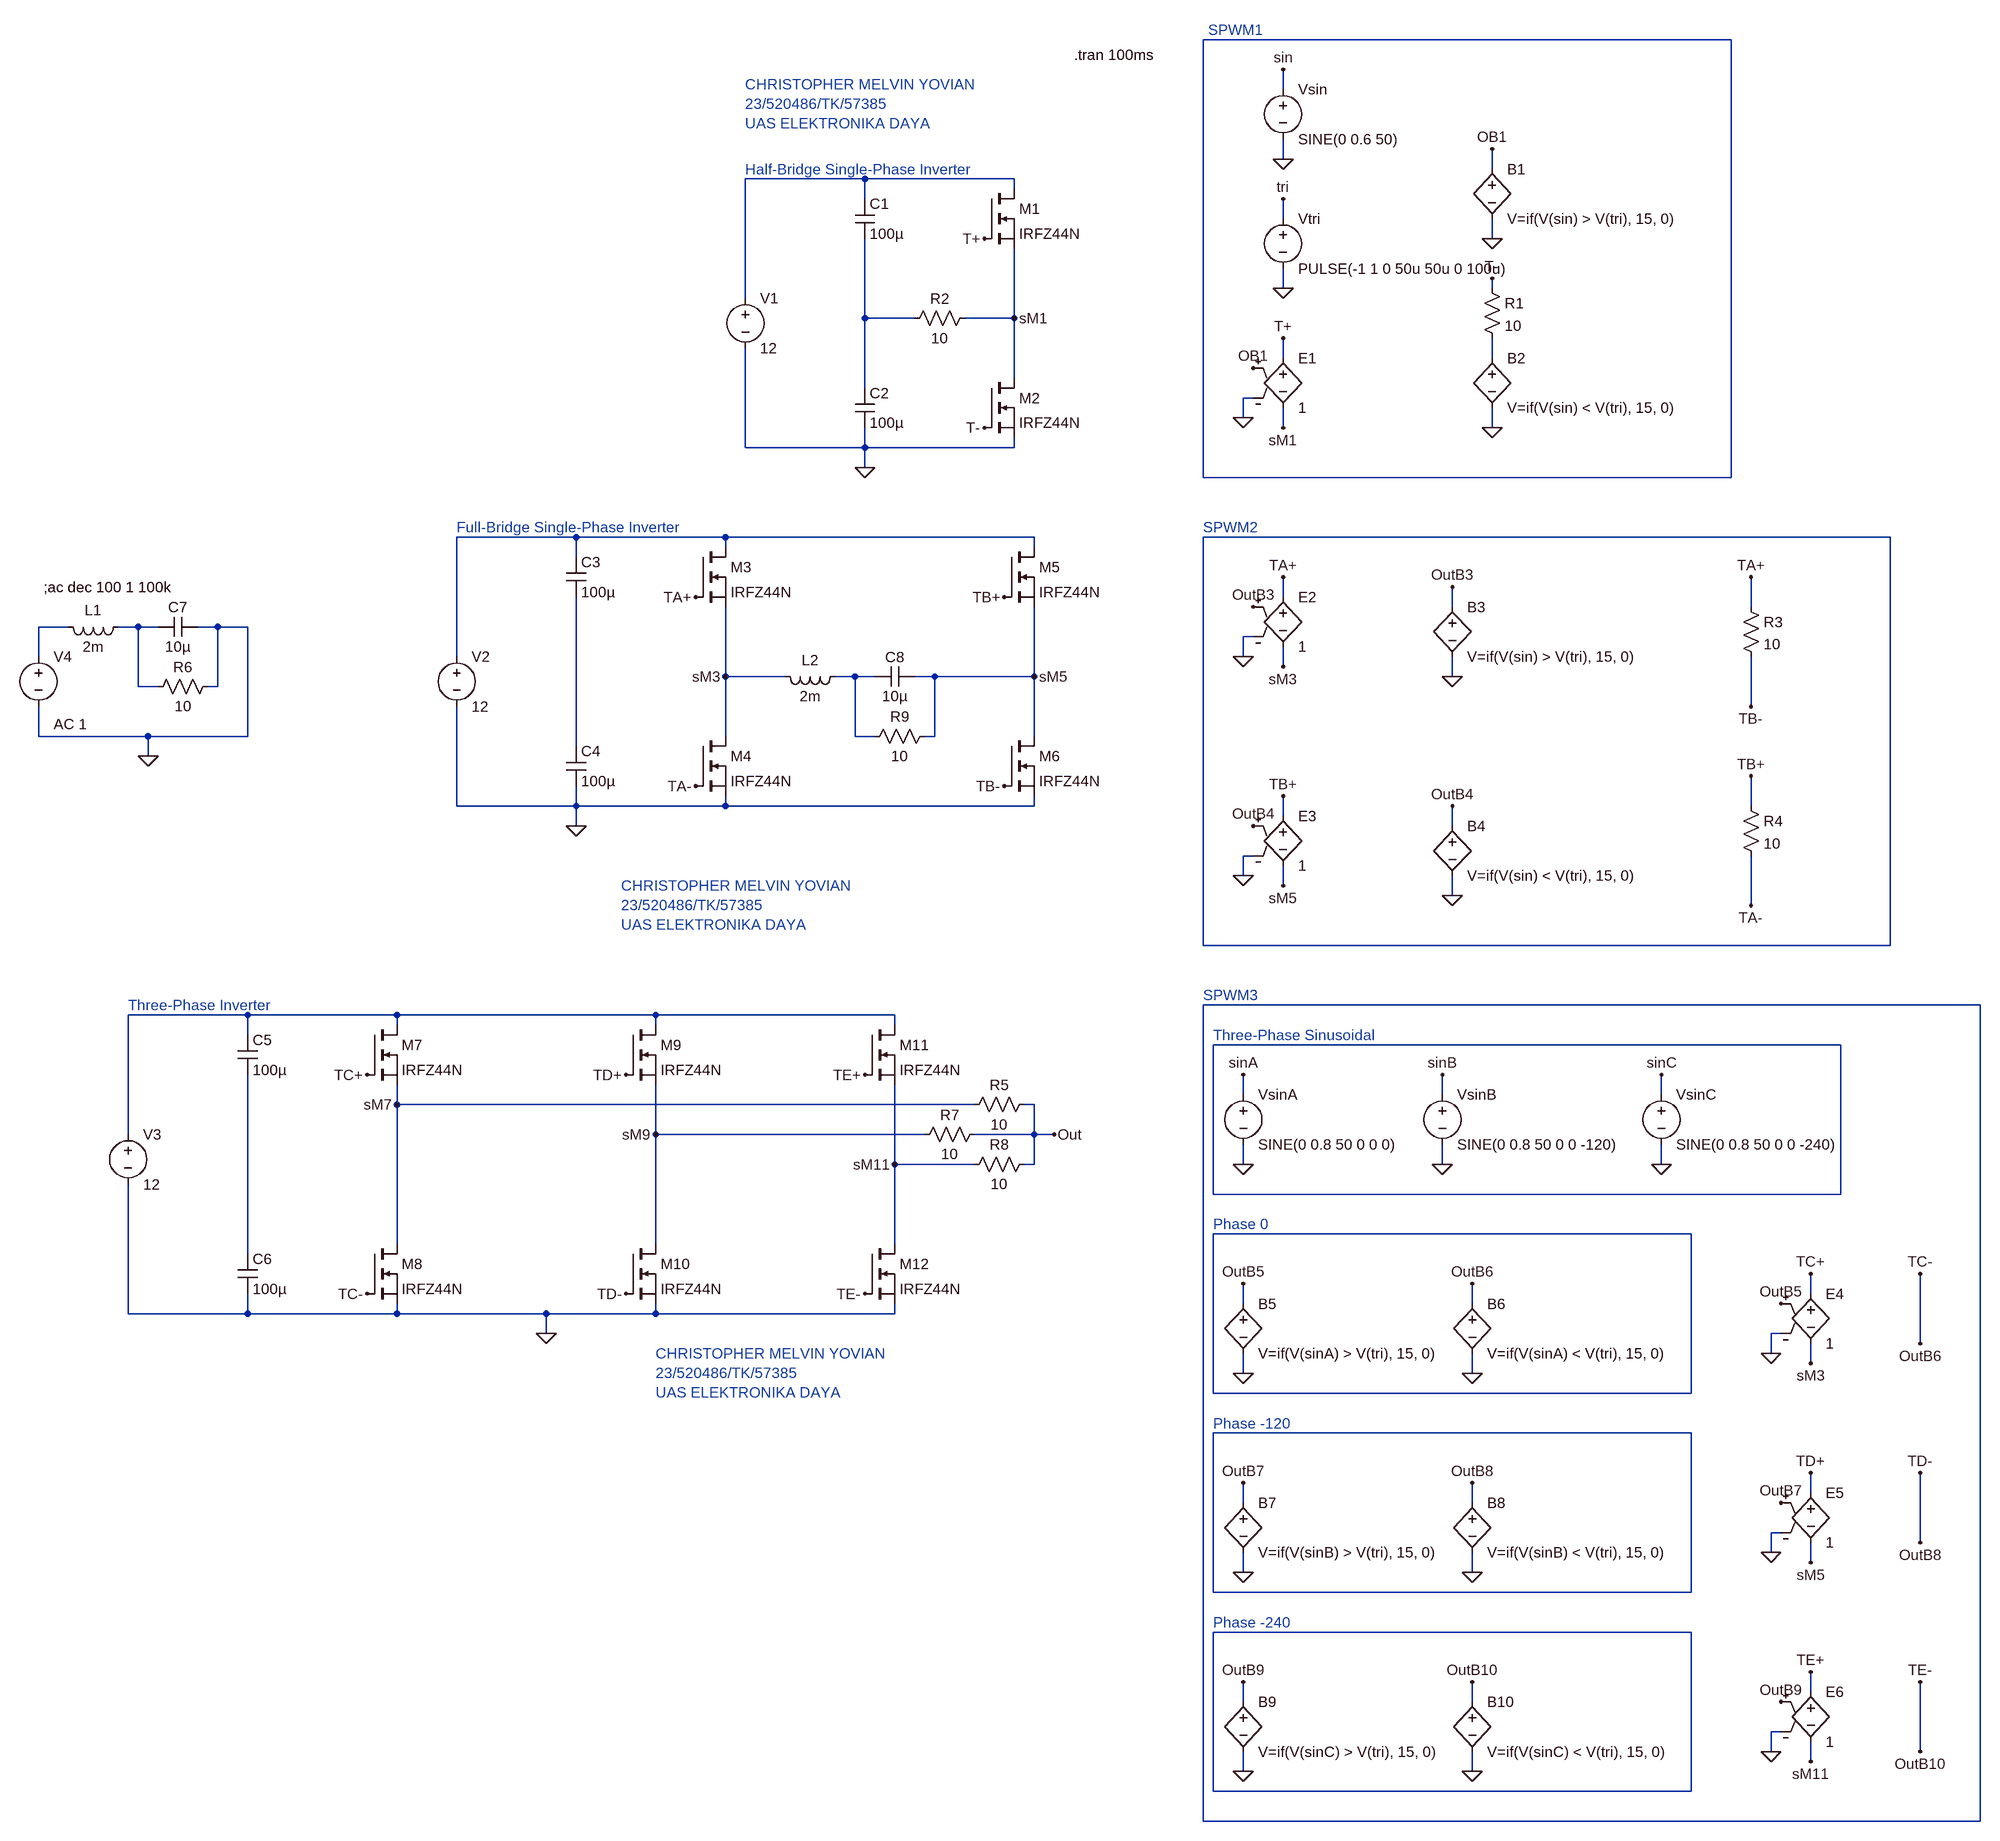
[diagram p0: schematic UAS Elday Task 2_520486.asc]
UAS Elday Task 2_520486.asc, the LTspice schematic file:
Version 4
SHEET 1 1808 2916
WIRE 1024 32 176 32
WIRE 304 112 304 80
WIRE 304 224 304 192
WIRE 640 240 640 208
WIRE -368 256 -560 256
WIRE -128 256 -368 256
WIRE -128 272 -128 256
WIRE -368 288 -368 256
WIRE 304 320 304 288
WIRE 640 352 640 320
WIRE 304 432 304 400
WIRE 640 432 640 416
WIRE -560 448 -560 256
WIRE -368 480 -368 352
WIRE -288 480 -368 480
WIRE -128 480 -128 368
WIRE -128 480 -208 480
WIRE 304 544 304 512
WIRE 640 544 640 512
WIRE -128 576 -128 480
WIRE -368 592 -368 480
WIRE 256 608 240 608
WIRE 240 640 240 608
WIRE 304 656 304 624
WIRE 640 656 640 624
WIRE -560 688 -560 528
WIRE -368 688 -368 656
WIRE -368 688 -560 688
WIRE -128 688 -128 672
WIRE -128 688 -368 688
WIRE -368 720 -368 688
WIRE 176 736 176 32
WIRE 1024 736 1024 32
WIRE 1024 736 176 736
WIRE -832 832 -1024 832
WIRE -592 832 -832 832
WIRE -96 832 -592 832
WIRE 1280 832 176 832
WIRE -592 848 -592 832
WIRE -96 848 -96 832
WIRE -832 864 -832 832
WIRE 304 928 304 896
WIRE 576 944 576 912
WIRE 1056 944 1056 896
WIRE -1648 976 -1696 976
WIRE -1536 976 -1568 976
WIRE -1504 976 -1536 976
WIRE -1408 976 -1440 976
WIRE -1360 976 -1408 976
WIRE 256 992 240 992
WIRE -1696 1024 -1696 976
WIRE -1024 1024 -1024 832
WIRE 240 1024 240 992
WIRE 304 1040 304 1008
WIRE -592 1056 -592 944
WIRE -496 1056 -592 1056
WIRE -384 1056 -416 1056
WIRE -352 1056 -384 1056
WIRE -256 1056 -288 1056
WIRE -96 1056 -96 944
WIRE -96 1056 -256 1056
WIRE 576 1056 576 1024
WIRE -1536 1072 -1536 976
WIRE -1504 1072 -1536 1072
WIRE -1408 1072 -1408 976
WIRE -1408 1072 -1424 1072
WIRE 1056 1104 1056 1024
WIRE -1696 1152 -1696 1104
WIRE -1520 1152 -1696 1152
WIRE -1360 1152 -1360 976
WIRE -1360 1152 -1520 1152
WIRE -592 1152 -592 1056
WIRE -384 1152 -384 1056
WIRE -352 1152 -384 1152
WIRE -256 1152 -256 1056
WIRE -256 1152 -272 1152
WIRE -96 1152 -96 1056
WIRE -832 1168 -832 928
WIRE -1520 1184 -1520 1152
WIRE -1024 1264 -1024 1104
WIRE -832 1264 -832 1232
WIRE -832 1264 -1024 1264
WIRE -592 1264 -592 1248
WIRE -592 1264 -832 1264
WIRE -96 1264 -96 1248
WIRE -96 1264 -592 1264
WIRE 1056 1264 1056 1216
WIRE 304 1280 304 1248
WIRE -832 1296 -832 1264
WIRE 576 1296 576 1264
WIRE 256 1344 240 1344
WIRE 240 1376 240 1344
WIRE 304 1392 304 1360
WIRE 576 1408 576 1376
WIRE 1056 1424 1056 1344
WIRE 176 1488 176 832
WIRE 1280 1488 1280 832
WIRE 1280 1488 176 1488
WIRE 1424 1584 176 1584
WIRE -1360 1600 -1552 1600
WIRE -1120 1600 -1360 1600
WIRE -704 1600 -1120 1600
WIRE -320 1600 -704 1600
WIRE -1120 1616 -1120 1600
WIRE -704 1616 -704 1600
WIRE -320 1616 -320 1600
WIRE -1360 1632 -1360 1600
WIRE 1200 1648 192 1648
WIRE 240 1728 240 1696
WIRE 560 1728 560 1696
WIRE 912 1728 912 1696
WIRE -1120 1744 -1120 1712
WIRE -192 1744 -1120 1744
WIRE -96 1744 -112 1744
WIRE -1552 1792 -1552 1600
WIRE -704 1792 -704 1712
WIRE -272 1792 -704 1792
WIRE -96 1792 -96 1744
WIRE -96 1792 -192 1792
WIRE -64 1792 -96 1792
WIRE -320 1840 -320 1712
WIRE -192 1840 -320 1840
WIRE -96 1840 -96 1792
WIRE -96 1840 -112 1840
WIRE 240 1840 240 1808
WIRE 560 1840 560 1808
WIRE 912 1840 912 1808
WIRE 192 1888 192 1648
WIRE 1200 1888 1200 1648
WIRE 1200 1888 192 1888
WIRE 960 1952 192 1952
WIRE -1120 1968 -1120 1744
WIRE -704 1968 -704 1792
WIRE -320 1968 -320 1840
WIRE -1360 1984 -1360 1696
WIRE 1152 2048 1152 2016
WIRE 240 2064 240 2032
WIRE 608 2064 608 2032
WIRE -1552 2080 -1552 1872
WIRE -1360 2080 -1360 2048
WIRE -1360 2080 -1552 2080
WIRE -1120 2080 -1120 2064
WIRE -1120 2080 -1360 2080
WIRE -880 2080 -1120 2080
WIRE -704 2080 -704 2064
WIRE -704 2080 -880 2080
WIRE -320 2080 -320 2064
WIRE -320 2080 -704 2080
WIRE -880 2112 -880 2080
WIRE 1104 2112 1088 2112
WIRE 1328 2128 1328 2016
WIRE 1088 2144 1088 2112
WIRE 1152 2160 1152 2128
WIRE 240 2176 240 2144
WIRE 608 2176 608 2144
WIRE 192 2208 192 1952
WIRE 960 2208 960 1952
WIRE 960 2208 192 2208
WIRE 960 2272 192 2272
WIRE 1152 2368 1152 2336
WIRE 240 2384 240 2352
WIRE 608 2384 608 2352
WIRE 1104 2432 1088 2432
WIRE 1328 2448 1328 2336
WIRE 1088 2464 1088 2432
WIRE 1152 2480 1152 2448
WIRE 240 2496 240 2464
WIRE 608 2496 608 2464
WIRE 192 2528 192 2272
WIRE 960 2528 960 2272
WIRE 960 2528 192 2528
WIRE 960 2592 192 2592
WIRE 1152 2688 1152 2656
WIRE 240 2704 240 2672
WIRE 608 2704 608 2672
WIRE 1104 2752 1088 2752
WIRE 1088 2784 1088 2752
WIRE 1328 2784 1328 2672
WIRE 1152 2800 1152 2768
WIRE 240 2816 240 2784
WIRE 608 2816 608 2784
WIRE 192 2848 192 2592
WIRE 960 2848 960 2592
WIRE 960 2848 192 2848
WIRE 176 2896 176 1584
WIRE 1424 2896 1424 1584
WIRE 1424 2896 176 2896
FLAG -176 352 T+
FLAG -176 656 T-
FLAG 304 512 T+
FLAG 640 416 T-
FLAG 640 656 0
FLAG 640 208 OB1
FLAG 640 352 0
FLAG 256 560 OB1
FLAG 240 640 0
FLAG 304 656 sM1
FLAG -128 480 sM1
FLAG 304 80 sin
FLAG 304 288 tri
FLAG 304 224 0
FLAG 304 432 0
FLAG -368 720 0
FLAG 304 896 TA+
FLAG 256 944 OutB3
FLAG 240 1024 0
FLAG 304 1040 sM3
FLAG 304 1248 TB+
FLAG 256 1296 OutB4
FLAG 240 1376 0
FLAG 304 1392 sM5
FLAG 576 912 OutB3
FLAG 576 1056 0
FLAG 576 1264 OutB4
FLAG 576 1408 0
FLAG 240 1696 sinA
FLAG 240 1840 0
FLAG 560 1696 sinB
FLAG 560 1840 0
FLAG 912 1696 sinC
FLAG 912 1840 0
FLAG 240 2032 OutB5
FLAG 240 2176 0
FLAG 608 2032 OutB6
FLAG 608 2176 0
FLAG 240 2352 OutB7
FLAG 240 2496 0
FLAG 608 2352 OutB8
FLAG 608 2496 0
FLAG 240 2672 OutB9
FLAG 240 2816 0
FLAG 608 2672 OutB10
FLAG 608 2816 0
FLAG 1152 2016 TC+
FLAG 1104 2064 OutB5
FLAG 1088 2144 0
FLAG 1152 2160 sM3
FLAG 1152 2336 TD+
FLAG 1104 2384 OutB7
FLAG 1088 2464 0
FLAG 1152 2480 sM5
FLAG 1152 2656 TE+
FLAG 1104 2704 OutB9
FLAG 1088 2784 0
FLAG 1152 2800 sM11
FLAG 1328 2128 OutB6
FLAG 1328 2016 TC-
FLAG 1328 2448 OutB8
FLAG 1328 2336 TD-
FLAG 1328 2784 OutB10
FLAG 1328 2672 TE-
FLAG -640 928 TA+
FLAG -640 1232 TA-
FLAG -592 1056 sM3
FLAG -832 1296 0
FLAG -144 928 TB+
FLAG -144 1232 TB-
FLAG -96 1056 sM5
FLAG -1168 1696 TC+
FLAG -1168 2048 TC-
FLAG -1120 1744 sM7
FLAG -752 1696 TD+
FLAG -752 2048 TD-
FLAG -704 1792 sM9
FLAG -368 1696 TE+
FLAG -368 2048 TE-
FLAG -320 1840 sM11
FLAG 1056 896 TA+
FLAG 1056 1104 TB-
FLAG 1056 1216 TB+
FLAG 1056 1424 TA-
FLAG -880 2112 0
FLAG -64 1792 Out
FLAG -1520 1184 0
SYMBOL voltage 304 304 R0
WINDOW 123 0 0 Left 0
WINDOW 39 0 0 Left 0
SYMATTR InstName Vtri
SYMATTR Value PULSE(-1 1 0 50u 50u 0 100u)
SYMBOL voltage 304 96 R0
WINDOW 123 0 0 Left 0
WINDOW 39 0 0 Left 0
SYMATTR InstName Vsin
SYMATTR Value SINE(0 0.6 50)
SYMBOL bv 640 224 R0
SYMATTR InstName B1
SYMATTR Value V=if(V(sin) > V(tri), 15, 0)
SYMBOL voltage -560 432 R0
SYMATTR InstName V1
SYMATTR Value 12
SYMBOL cap -384 288 R0
SYMATTR InstName C1
SYMATTR Value 100µ
SYMBOL cap -384 592 R0
SYMATTR InstName C2
SYMATTR Value 100µ
SYMBOL nmos -176 272 R0
SYMATTR InstName M1
SYMATTR Value IRFZ44N
SYMBOL nmos -176 576 R0
SYMATTR InstName M2
SYMATTR Value IRFZ44N
SYMBOL e 304 528 R0
SYMATTR InstName E1
SYMATTR Value 1
SYMBOL bv 640 528 R0
SYMATTR InstName B2
SYMATTR Value V=if(V(sin) < V(tri), 15, 0)
SYMBOL res 624 416 R0
SYMATTR InstName R1
SYMATTR Value 10
SYMBOL res -192 464 R90
WINDOW 0 0 56 VBottom 2
WINDOW 3 32 56 VTop 2
SYMATTR InstName R2
SYMATTR Value 10
SYMBOL e 304 912 R0
SYMATTR InstName E2
SYMATTR Value 1
SYMBOL e 304 1264 R0
SYMATTR InstName E3
SYMATTR Value 1
SYMBOL bv 576 928 R0
SYMATTR InstName B3
SYMATTR Value V=if(V(sin) > V(tri), 15, 0)
SYMBOL bv 576 1280 R0
SYMATTR InstName B4
SYMATTR Value V=if(V(sin) < V(tri), 15, 0)
SYMBOL voltage 240 1712 R0
WINDOW 123 0 0 Left 0
WINDOW 39 0 0 Left 0
SYMATTR InstName VsinA
SYMATTR Value SINE(0 0.8 50 0 0 0)
SYMBOL voltage 560 1712 R0
WINDOW 123 0 0 Left 0
WINDOW 39 0 0 Left 0
SYMATTR InstName VsinB
SYMATTR Value SINE(0 0.8 50 0 0 -120)
SYMBOL voltage 912 1712 R0
WINDOW 123 0 0 Left 0
WINDOW 39 0 0 Left 0
SYMATTR InstName VsinC
SYMATTR Value SINE(0 0.8 50 0 0 -240)
SYMBOL bv 240 2048 R0
SYMATTR InstName B5
SYMATTR Value V=if(V(sinA) > V(tri), 15, 0)
SYMBOL bv 608 2048 R0
SYMATTR InstName B6
SYMATTR Value V=if(V(sinA) < V(tri), 15, 0)
SYMBOL bv 240 2368 R0
SYMATTR InstName B7
SYMATTR Value V=if(V(sinB) > V(tri), 15, 0)
SYMBOL bv 608 2368 R0
SYMATTR InstName B8
SYMATTR Value V=if(V(sinB) < V(tri), 15, 0)
SYMBOL bv 240 2688 R0
SYMATTR InstName B9
SYMATTR Value V=if(V(sinC) > V(tri), 15, 0)
SYMBOL bv 608 2688 R0
SYMATTR InstName B10
SYMATTR Value V=if(V(sinC) < V(tri), 15, 0)
SYMBOL e 1152 2032 R0
SYMATTR InstName E4
SYMATTR Value 1
SYMBOL e 1152 2352 R0
SYMATTR InstName E5
SYMATTR Value 1
SYMBOL e 1152 2672 R0
SYMATTR InstName E6
SYMATTR Value 1
SYMBOL voltage -1024 1008 R0
SYMATTR InstName V2
SYMATTR Value 12
SYMBOL cap -848 864 R0
SYMATTR InstName C3
SYMATTR Value 100µ
SYMBOL cap -848 1168 R0
SYMATTR InstName C4
SYMATTR Value 100µ
SYMBOL nmos -640 848 R0
SYMATTR InstName M3
SYMATTR Value IRFZ44N
SYMBOL nmos -640 1152 R0
SYMATTR InstName M4
SYMATTR Value IRFZ44N
SYMBOL nmos -144 848 R0
SYMATTR InstName M5
SYMATTR Value IRFZ44N
SYMBOL nmos -144 1152 R0
SYMATTR InstName M6
SYMATTR Value IRFZ44N
SYMBOL voltage -1552 1776 R0
SYMATTR InstName V3
SYMATTR Value 12
SYMBOL cap -1376 1632 R0
SYMATTR InstName C5
SYMATTR Value 100µ
SYMBOL cap -1376 1984 R0
SYMATTR InstName C6
SYMATTR Value 100µ
SYMBOL nmos -1168 1616 R0
SYMATTR InstName M7
SYMATTR Value IRFZ44N
SYMBOL nmos -1168 1968 R0
SYMATTR InstName M8
SYMATTR Value IRFZ44N
SYMBOL nmos -752 1616 R0
SYMATTR InstName M9
SYMATTR Value IRFZ44N
SYMBOL nmos -752 1968 R0
SYMATTR InstName M10
SYMATTR Value IRFZ44N
SYMBOL nmos -368 1616 R0
SYMATTR InstName M11
SYMATTR Value IRFZ44N
SYMBOL nmos -368 1968 R0
SYMATTR InstName M12
SYMATTR Value IRFZ44N
SYMBOL res 1040 928 R0
SYMATTR InstName R3
SYMATTR Value 10
SYMBOL res 1040 1248 R0
SYMATTR InstName R4
SYMATTR Value 10
SYMBOL cap -1440 960 R90
WINDOW 0 0 32 VBottom 2
WINDOW 3 32 32 VTop 2
SYMATTR InstName C7
SYMATTR Value 10µ
SYMBOL ind -1552 960 R90
WINDOW 0 5 56 VBottom 2
WINDOW 3 32 56 VTop 2
SYMATTR InstName L1
SYMATTR Value 2m
SYMBOL res -1408 1056 R90
WINDOW 0 0 56 VBottom 2
WINDOW 3 32 56 VTop 2
SYMATTR InstName R6
SYMATTR Value 10
SYMBOL res -96 1728 R90
WINDOW 0 0 56 VBottom 2
WINDOW 3 32 56 VTop 2
SYMATTR InstName R5
SYMATTR Value 10
SYMBOL res -176 1776 R90
WINDOW 0 0 56 VBottom 2
WINDOW 3 32 56 VTop 2
SYMATTR InstName R7
SYMATTR Value 10
SYMBOL res -96 1824 R90
WINDOW 0 0 56 VBottom 2
WINDOW 3 32 56 VTop 2
SYMATTR InstName R8
SYMATTR Value 10
SYMBOL voltage -1696 1008 R0
WINDOW 123 24 124 Left 2
WINDOW 39 0 0 Left 0
SYMATTR Value2 AC 1
SYMATTR InstName V4
SYMATTR Value ""
SYMBOL cap -288 1040 R90
WINDOW 0 0 32 VBottom 2
WINDOW 3 32 32 VTop 2
SYMATTR InstName C8
SYMATTR Value 10µ
SYMBOL ind -400 1040 R90
WINDOW 0 5 56 VBottom 2
WINDOW 3 32 56 VTop 2
SYMATTR InstName L2
SYMATTR Value 2m
SYMBOL res -256 1136 R90
WINDOW 0 0 56 VBottom 2
WINDOW 3 32 56 VTop 2
SYMATTR InstName R9
SYMATTR Value 10
TEXT 184 16 Left 2 ;SPWM1
TEXT -32 56 Left 2 !.tran 100ms
TEXT 176 816 Left 2 ;SPWM2
TEXT 176 1568 Left 2 ;SPWM3
TEXT -560 240 Left 2 ;Half-Bridge Single-Phase Inverter
TEXT -1024 816 Left 2 ;Full-Bridge Single-Phase Inverter
TEXT -1552 1584 Left 2 ;Three-Phase Inverter
TEXT -760 1392 Left 2 ;CHRISTOPHER MELVIN YOVIAN\n23/520486/TK/57385\nUAS ELEKTRONIKA DAYA
TEXT 192 1632 Left 2 ;Three-Phase Sinusoidal
TEXT 192 1936 Left 2 ;Phase 0
TEXT 192 2256 Left 2 ;Phase -120
TEXT 192 2576 Left 2 ;Phase -240
TEXT -560 104 Left 2 ;CHRISTOPHER MELVIN YOVIAN\n23/520486/TK/57385\nUAS ELEKTRONIKA DAYA
TEXT -704 2144 Left 2 ;CHRISTOPHER MELVIN YOVIAN\n23/520486/TK/57385\nUAS ELEKTRONIKA DAYA
TEXT -1688 912 Left 2 !;ac dec 100 1 100k

The netlist it stands for:
* UAS Elday Task 2_520486.asc
Vtri tri 0 PULSE(-1 1 0 50u 50u 0 100u)
Vsin sin 0 SINE(0 0.6 50)
B1 OB1 0 V=if(V(sin) > V(tri), 15, 0)
V1 N002 0 12
C1 N002 N003 100µ
C2 N003 0 100µ
M1 N002 T+ sM1 sM1 IRFZ44N
M2 sM1 T- 0 0 IRFZ44N
E1 T+ sM1 OB1 0 1
B2 N004 0 V=if(V(sin) < V(tri), 15, 0)
R1 T- N004 10
R2 sM1 N003 10
E2 TA+ sM3 OutB3 0 1
E3 TB+ sM5 OutB4 0 1
B3 OutB3 0 V=if(V(sin) > V(tri), 15, 0)
B4 OutB4 0 V=if(V(sin) < V(tri), 15, 0)
VsinA sinA 0 SINE(0 0.8 50 0 0 0)
VsinB sinB 0 SINE(0 0.8 50 0 0 -120)
VsinC sinC 0 SINE(0 0.8 50 0 0 -240)
B5 OutB5 0 V=if(V(sinA) > V(tri), 15, 0)
B6 TC- 0 V=if(V(sinA) < V(tri), 15, 0)
B7 OutB7 0 V=if(V(sinB) > V(tri), 15, 0)
B8 TD- 0 V=if(V(sinB) < V(tri), 15, 0)
B9 OutB9 0 V=if(V(sinC) > V(tri), 15, 0)
B10 TE- 0 V=if(V(sinC) < V(tri), 15, 0)
E4 TC+ sM3 OutB5 0 1
E5 TD+ sM5 OutB7 0 1
E6 TE+ sM11 OutB9 0 1
V2 N005 0 12
C3 N005 N010 100µ
C4 N010 0 100µ
M3 N005 TA+ sM3 sM3 IRFZ44N
M4 sM3 TA- 0 0 IRFZ44N
M5 N005 TB+ sM5 sM5 IRFZ44N
M6 sM5 TB- 0 0 IRFZ44N
V3 N012 0 12
C5 N012 N015 100µ
C6 N015 0 100µ
M7 N012 TC+ sM7 sM7 IRFZ44N
M8 sM7 TC- 0 0 IRFZ44N
M9 N012 TD+ sM9 sM9 IRFZ44N
M10 sM9 TD- 0 0 IRFZ44N
M11 N012 TE+ sM11 sM11 IRFZ44N
M12 sM11 TE- 0 0 IRFZ44N
R3 TA+ TB- 10
R4 TB+ TA- 10
C7 0 N008 10µ
L1 N008 N007 2m
R6 0 N008 10
R5 Out sM7 10
R7 Out sM9 10
R8 Out sM11 10
V4 N007 0 AC 1
C8 sM5 N009 10µ
L2 N009 sM3 2m
R9 sM5 N009 10
.model NMOS NMOS
.model PMOS PMOS
.lib standard.mos
* SPWM1
.tran 100ms
* SPWM2
* SPWM3
* Half-Bridge Single-Phase Inverter
* Full-Bridge Single-Phase Inverter
* Three-Phase Inverter
* CHRISTOPHER MELVIN YOVIAN
* 23/520486/TK/57385
* UAS ELEKTRONIKA DAYA
* Three-Phase Sinusoidal
* Phase 0
* Phase -120
* Phase -240
* CHRISTOPHER MELVIN YOVIAN
* 23/520486/TK/57385
* UAS ELEKTRONIKA DAYA
* CHRISTOPHER MELVIN YOVIAN
* 23/520486/TK/57385
* UAS ELEKTRONIKA DAYA
;ac dec 100 1 100k
.backanno
.end